# EAGLE design Projet_Schematics (EAGLE 9.5.2)
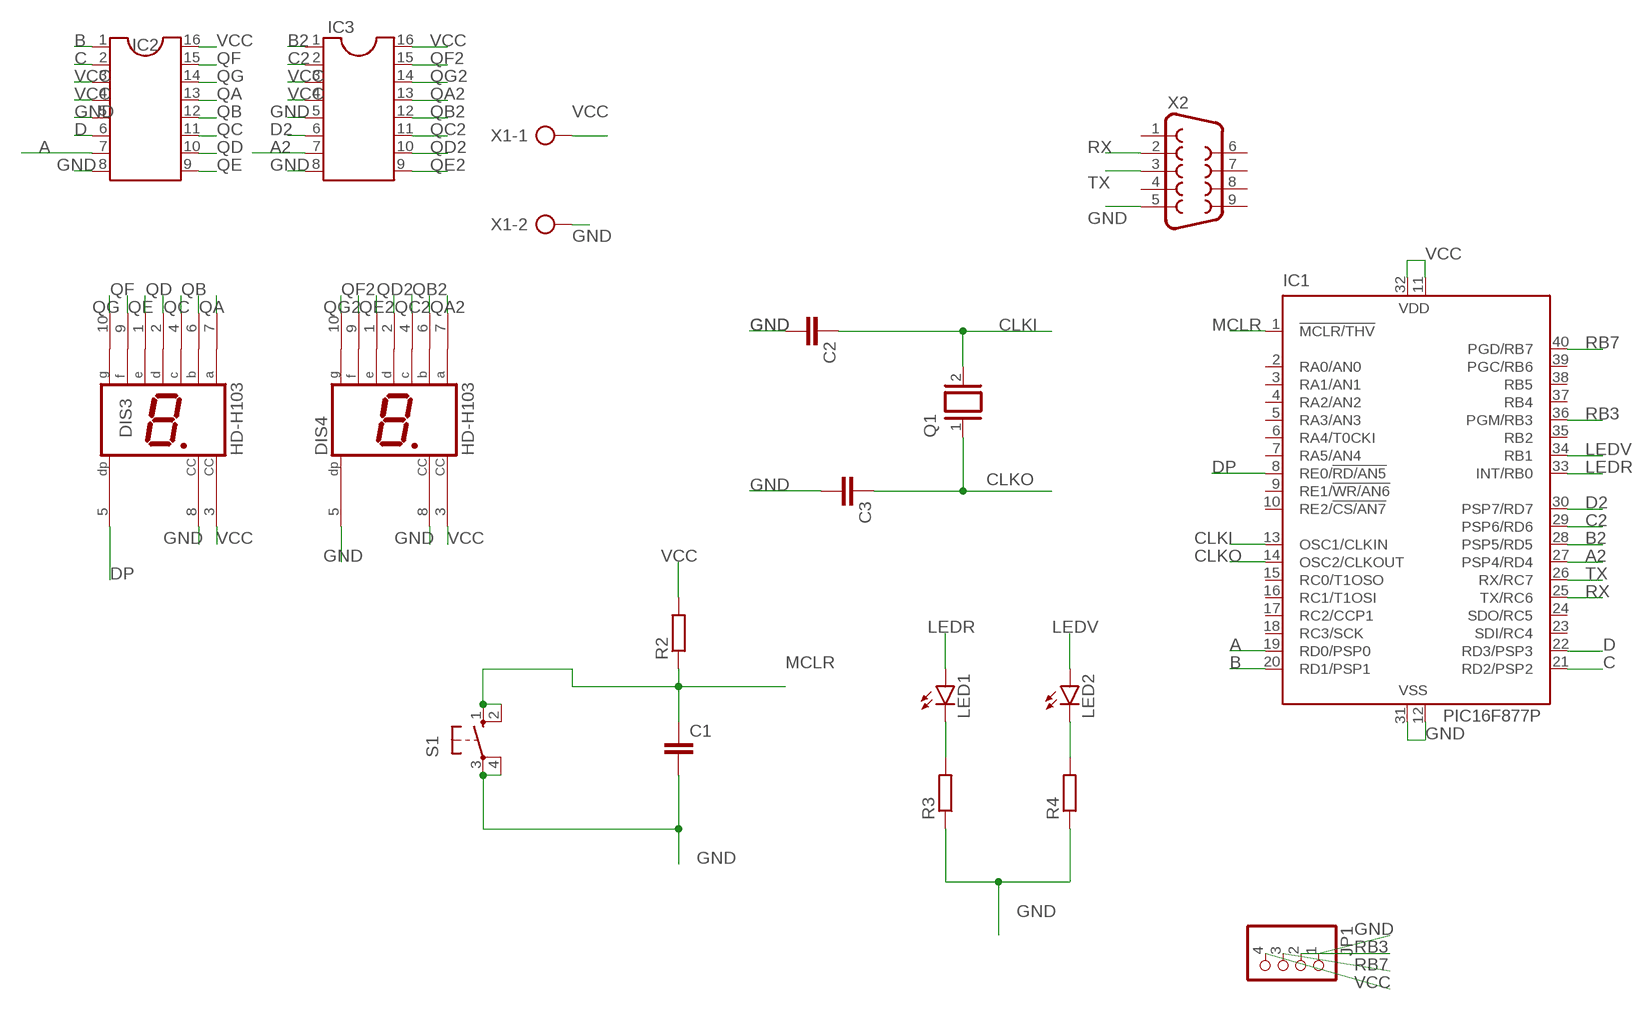
[diagram p0: schematic, sheet 1]

## Parts
C1  C-EU025-030X050  [C025-030X050]
C2  C-EU025-030X050  [C025-030X050]
C3  C-EU025-030X050  [C025-030X050]
DIS3  HD-H103  [HDSP-M]
DIS4  HD-H103  [HDSP-M]
IC1  PIC16F877P  [DIL40]
IC2  DIL16  [DIL16]
IC3  DIL16  [DIL16]
JP1  PINHD-1X4  [1X04]
LED1  LED5MM  [LED5MM]
LED2  LED5MM  [LED5MM]
Q1  XTAL/S  [QS]
R2  R-EU_0204/7  [0204/7]
R3  R-EU_0204/7  [0204/7]
R4  R-EU_0204/7  [0204/7]
S1  10-XX  [B3F-10XX]
X1  AK300/2  [AK300/2]
X2  F09H  [F09H]

## Nets
A: IC1.19(RD0/PSP0) IC2.7
A2: IC1.27(PSP4/RD4) IC3.7
B: IC1.20(RD1/PSP1) IC2.1
B2: IC1.28(PSP5/RD5) IC3.1
C: IC1.21(RD2/PSP2) IC2.2
C2: IC1.29(PSP6/RD6) IC3.2
CLKI: C2.1 IC1.13(OSC1/CLKIN) Q1.2
CLKO: C3.1 IC1.14(OSC2/CLKOUT) Q1.1
D: IC1.22(RD3/PSP3) IC2.6
D2: IC1.30(PSP7/RD7) IC3.6
DP: DIS3.5(DP) IC1.8(RE0/!RD/AN5)
GND: C1.2 C2.2 C3.2 DIS3.8(CC) DIS4.5(DP) DIS4.8(CC) IC1.12(VSS) IC1.31(VSS) IC2.5 IC2.8 IC3.5 IC3.8 JP1.1 R3.1 R4.1 S1.3(P) S1.4(P1) X1.2 X2.5
LEDR: IC1.33(INT/RB0) LED1.A
LEDV: IC1.34(RB1) LED2.A
MCLR: C1.1 IC1.1(!MCLR/THV) R2.1 S1.1(S) S1.2(S1)
N$1: LED1.K(C) R3.2
N$2: LED2.K(C) R4.2
QA: DIS3.7(A) IC2.13
QA2: DIS4.7(A) IC3.13
QB: DIS3.6(B) IC2.12
QB2: DIS4.6(B) IC3.12
QC: DIS3.4(C) IC2.11
QC2: DIS4.4(C) IC3.11
QD: DIS3.2(D) IC2.10
QD2: DIS4.2(D) IC3.10
QE: DIS3.1(E) IC2.9
QE2: DIS4.1(E) IC3.9
QF: DIS3.9(F) IC2.15
QF2: DIS4.9(F) IC3.15
QG: DIS3.10(G) IC2.14
QG2: DIS4.10(G) IC3.14
RB3: IC1.36(PGM/RB3) JP1.2
RB7: IC1.40(PGD/RB7) JP1.3
RX: IC1.25(TX/RC6) X2.2
TX: IC1.26(RX/RC7) X2.3
VCC: DIS3.3(CC) DIS4.3(CC) IC1.11(VDD) IC1.32(VDD) IC2.3 IC2.4 IC2.16 IC3.3 IC3.4 IC3.16 JP1.4 R2.2 X1.1
Unconnected: IC1.2(RA0/AN0) IC1.3(RA1/AN1) IC1.4(RA2/AN2) IC1.5(RA3/AN3) IC1.6(RA4/T0CKI) IC1.7(RA5/AN4) IC1.9(RE1/!WR/AN6) IC1.10(RE2/!CS/AN7) IC1.15(RC0/T1OSO) IC1.16(RC1/T1OSI) IC1.17(RC2/CCP1) IC1.18(RC3/SCK) IC1.23(SDI/RC4) IC1.24(SDO/RC5) IC1.35(RB2) IC1.37(RB4) IC1.38(RB5) IC1.39(PGC/RB6) X2.1 X2.4 X2.6 X2.7 X2.8 X2.9

## Library data of the parts
C1-C3 = rcl:C-EU: CAPACITOR, European symbol; SPICEPREFIX: C
DIS3 DIS4 = display-hp:HD-H103: LED DISPLAY 1-character 7 segment, decimal point right; OC_FARNELL: unknown; OC_NEWARK: unknown
IC1 = microchip:PIC16F87*: MICROCONTROLLER; MF: MICROCHIP; MPN: PIC16F877-04/P; OC_FARNELL: 9761349; OC_NEWARK: 61K3463
IC2 IC3 = ic-package:DIL16: Dual In Line / Socket
JP1 = pinhead:PINHD-1X4: PIN HEADER
LED1 LED2 = led:LED: LED OSRAM: - CHIPLED LG R971, LG N971, LY N971, LG Q971, LY Q971, LO R971, LY R971 LH N974, LH R974 LS Q976, LO Q976, LY Q976 LO Q996 - Hyper CHIPLED LW Q18S LB Q993, LB Q99A, LB R99A - SideLED LS A670, LO A670, LY A670, LG A670, LP A670 LB A673, LV A673, LT A673, LW A673 LH A674 LY A675 LS A676, LA A676, LO A676, LY A676, LW A676 LS A679, LY A679, LG A679 - Hyper Micro SIDELED® LS Y876, LA Y876, LO Y876, LY Y876 LT Y87S - SmartLED LW L88C, LW L88S LB L89C, LB L89S, LG L890 LS L89K, LO L89K, LY L89K LS L896, LA L896, LO L896, LY L896 - TOPLED LS T670, LO T670, LY T670, LG T670, LP T670 LSG T670, LSP T670, LSY T670, LOP T670, LYG T670 LG T671, LOG T671, LSG T671 LB T673, LV T673, LT T673, LW T673 LH T674 LS T676, LA T676, LO T676, LY T676, LB T676, LH T676, LSB T676, LW T676 LB T67C, LV T67C, LT T67C, LS T67K, LO T67K, LY T67K, LW E67C LS E67B, LA E67B, LO E67B, LY E67B, LB E67C, LV E67C, LT E67C LW T67C LS T679, LY T679, LG T679 LS T770, LO T770, LY T770, LG T770, LP T770 LB T773, LV T773, LT T773, LW T773 LH T774 LS E675, LA E675, LY E675, LS T675 LS T776, LA T776, LO T776, LY T776, LB T776 LHGB T686 LT T68C, LB T68C - Hyper Mini TOPLED® LB M676 - Mini TOPLED Santana® LG M470 LS M47K, LO M47K, LY M47K Source: http://www.osram.convergy.de LUXEON: - LUMILED® LXK2-PW12-R00, LXK2-PW12-S00, LXK2-PW14-U00, LXK2-PW14-V00 LXK2-PM12-R00, LXK2-PM12-S00, LXK2-PM14-U00 LXK2-PE12-Q00, LXK2-PE12-R00, LXK2-PE12-S00, LXK2-PE14-T00, LXK2-PE14-U00 LXK2-PB12-K00, LXK2-PB12-L00, LXK2-PB12-M00, LXK2-PB14-N00, LXK2-PB14-P00, LXK2-PB14-Q00 LXK2-PR12-L00, LXK2-PR12-M00, LXK2-PR14-Q00, LXK2-PR14-R00 LXK2-PD12-Q00, LXK2-PD12-R00, LXK2-PD12-S00 LXK2-PH12-R00, LXK2-PH12-S00 LXK2-PL12-P00, LXK2-PL12-Q00, LXK2-PL12-R00 Source: www.luxeon.com KINGBRIGHT: KA-3528ASYC Source: www.kingbright.com
Q1 = special:XTAL/S: CRYSTAL
R2-R4 = rcl:R-EU_: RESISTOR, European symbol; SPICEPREFIX: R
S1 = switch-omron:10-XX: OMRON SWITCH; MPN: B3F-1000; OC_FARNELL: 176432; OC_NEWARK: 36M3542
X1 = con-ptr500:AK300/2: CONNECTOR; OC_FARNELL: unknown; OC_NEWARK: unknown
X2 = con-subd:F09: SUB-D; OC_FARNELL: unknown; OC_NEWARK: unknown

## Board
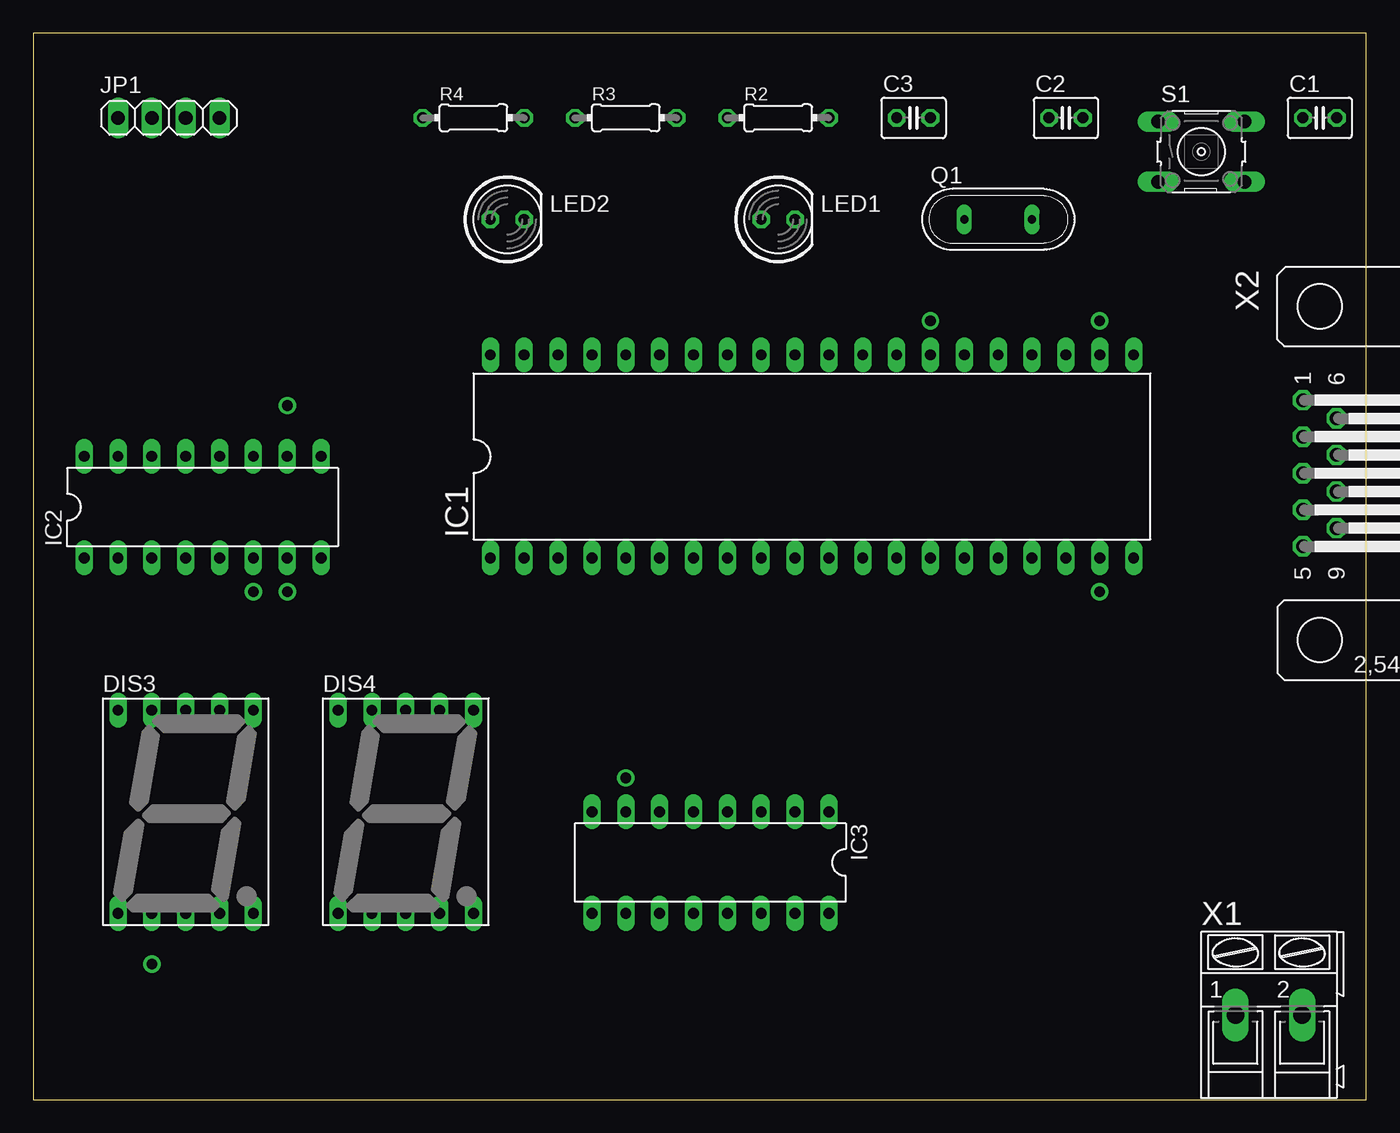
[diagram p1: board, top side]
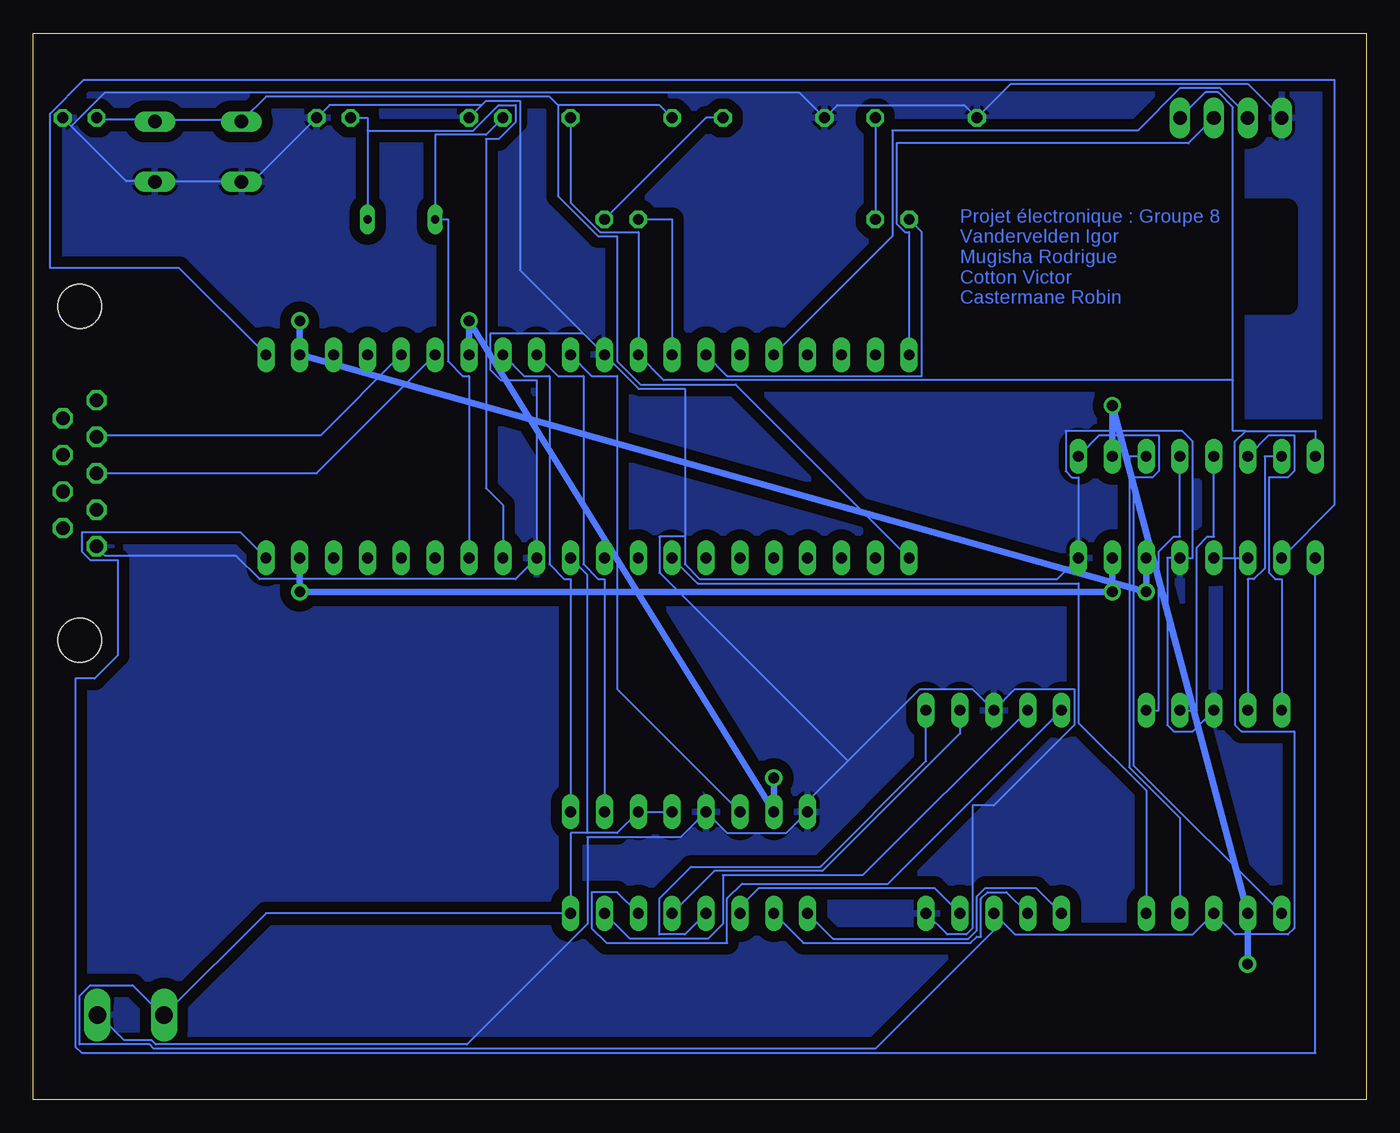
[diagram p2: board, bottom side, seen from below]

Size 100 x 80 mm. Coordinates in mm from the lower left corner, seen from the top.
Outline: 0,0 100,0 100,80 0,80 0,0
Copper layers (1*16): Top 0.035mm / dielectric 1.5mm / Bottom 0.035mm
Design rules "default": minimum track width 6mil, minimum drill 0.35mm, track to track 6mil, track to pad 6mil, pad to pad 6mil, via to via 6mil, smd to smd 6mil, copper to edge 40mil, drill to drill 6mil, minimum pad ring 10mil, minimum via ring 8mil, stop-mask expansion 4mil, vias tented up to drill 0mil, thermal gap 10mil

### Footprints (pad centres in the part's own frame; a part is rotated, then mirrored left to right if it is on the bottom)
C025-030X050 = drill 0.813 octagon: 1 -1.27,0; 2 1.27,0
HDSP-M = drill 0.813 long: 1 -5.08,-7.62; 2 -2.54,-7.62; 3 0,-7.62; 4 2.54,-7.62; 5 5.08,-7.62; 6 5.08,7.62; 7 2.54,7.62; 8 0,7.62; 9 -2.54,7.62; 10 -5.08,7.62
DIL40 = drill 0.813 long: 1 -24.13,-7.62; 2 -21.59,-7.62; 3 -19.05,-7.62; 4 -16.51,-7.62; 5 -13.97,-7.62; 6 -11.43,-7.62; 7 -8.89,-7.62; 8 -6.35,-7.62; 9 -3.81,-7.62; 10 -1.27,-7.62; 11 1.27,-7.62; 12 3.81,-7.62; 13 6.35,-7.62; 14 8.89,-7.62; 15 11.43,-7.62; 16 13.97,-7.62; 17 16.51,-7.62; 18 19.05,-7.62; 19 21.59,-7.62; 20 24.13,-7.62; 21 24.13,7.62; 22 21.59,7.62; 23 19.05,7.62; 24 16.51,7.62; 25 13.97,7.62; 26 11.43,7.62; 27 8.89,7.62; 28 6.35,7.62; 29 3.81,7.62; 30 1.27,7.62; 31 -1.27,7.62; 32 -3.81,7.62; 33 -6.35,7.62; 34 -8.89,7.62; 35 -11.43,7.62; 36 -13.97,7.62; 37 -16.51,7.62; 38 -19.05,7.62; 39 -21.59,7.62; 40 -24.13,7.62
DIL16 = drill 0.813 long: 1 -8.89,-3.81; 2 -6.35,-3.81; 3 -3.81,-3.81; 4 -1.27,-3.81; 5 1.27,-3.81; 6 3.81,-3.81; 7 6.35,-3.81; 8 8.89,-3.81; 9 8.89,3.81; 10 6.35,3.81; 11 3.81,3.81; 12 1.27,3.81; 13 -1.27,3.81; 14 -3.81,3.81; 15 -6.35,3.81; 16 -8.89,3.81
1X04 = drill 1.016 long: 1 -3.81,0; 2 -1.27,0; 3 1.27,0; 4 3.81,0
LED5MM = drill 0.813 octagon: A -1.27,0; K 1.27,0
QS = drill 0.61 long: 1 -2.54,0; 2 2.54,0
0204/7 = drill 0.813 octagon: 1 -3.81,0; 2 3.81,0
B3F-10XX = drill 1.016 long: 1 -3.251,2.261; 2 3.251,2.261; 3 -3.251,-2.261; 4 3.251,-2.261
AK300/2 = drill 1.321 long: 1 -2.515,0; 2 2.489,0
F09H = drill 1.016 octagon: 1 -5.486,-1.27; 2 -2.743,-1.27; 3 0,-1.27; 4 2.743,-1.27; 5 5.486,-1.27; 6 -4.115,1.27; 7 -1.372,1.27; 8 1.372,1.27; 9 4.115,1.27 | hole 3.302: -12.522,0; 12.522,0

### Placement (x,y rotation side)
C1  96.52,73.66 0 top
C2  77.47,73.66 0 top
C3  66.04,73.66 0 top
DIS3  11.43,21.59 0 top
DIS4  27.94,21.59 0 top
IC1  58.42,48.26 0 top
IC2  12.7,44.45 0 top
IC3  50.8,17.78 180 top
JP1  10.16,73.66 0 top
LED1  55.88,66.04 0 top
LED2  35.56,66.04 0 top
Q1  72.39,66.04 0 top
R2  55.88,73.66 0 top
R3  44.45,73.66 0 top
R4  33.02,73.66 0 top
S1  87.63,71.12 0 top
X1  92.71,6.35 0 top
X2  96.52,46.99 270 top

### Tracks (layer width: path | path; a pad name or v marks a point on that pad's centre or on a via)
A  (via drill 0.8 pad 1.3)
  Bottom 0.5: IC2.7 v19.05,38.1 v80.01,38.1 IC1.19
A2  (via drill 0.8 pad 1.3)
  Bottom 0.5: v44.45,24.13 IC3.7 v67.31,58.42 IC1.27
B
  Bottom 0.152: IC2.1 3.81,3.49 96.36,3.49 96.84,3.97 96.84,31.59 95.41,31.59 93.66,33.34 93.66,40.48 95.73,40.48 96.36,41.12 96.36,42.55 84.45,42.55 IC1.20
B2
  Bottom 0.152: IC3.1 59.69,39.05 60.17,39.05 61.28,40.16 61.28,54.29 63.18,54.29 IC1.28
C
  Bottom 0.152: IC2.2 2.38,44.61 2.38,76.52 96.2,76.52 98.74,73.98 98.74,62.39 89.06,62.39 IC1.21
C2
  Bottom 0.152: IC3.2 57.15,39.05 57.63,39.05 58.74,40.16 58.74,54.29 60.64,54.29 IC1.29
CLKI
  Bottom 0.152: 74.93,72.71 74.93,73.66 C2.1 | 74.93,72.71 Q1.2 | IC1.13 64.77,44.61 66.04,45.88 66.04,72.07 65.09,72.07 63.82,73.34 63.82,74.61 65.09,74.61 66.99,72.71 74.93,72.71
CLKO
  Bottom 0.152: C3.1 66.04,72.39 69.85,72.39 Q1.1 68.9,66.04 68.9,55.4 67.79,54.29 67.31,54.29 IC1.14
D  (via drill 0.8 pad 1.3)
  Bottom 0.5: v80.01,58.42 IC1.22 v16.51,38.1 IC2.6
D2
  Bottom 0.152: IC3.6 56.2,30.8 56.2,54.29 58.1,54.29 IC1.30
DP
  Bottom 0.152: DIS3.5 16.51,23.18 21.59,28.26 21.59,38.73 50.16,38.73 IC1.8
GND
  Bottom 0.152: DIS4.5 31.43,12.38 30,12.38 29.53,12.86 29.53,22.07 27.94,22.07 21.91,28.1 21.91,30.8 26.35,30.8 DIS4.8 29.53,30.8 33.5,30.8 38.89,25.4 | X1.2 95.09,6.35 93.19,4.45 91.12,4.45 90.81,4.13 67.47,4.13 58.42,13.18 58.42,19.68 51.44,19.68 IC3.5 47.94,20 43.5,20 IC3.8 41.91,22.38 38.89,25.4 | JP1.1 8.89,76.2 26.67,76.2 R4.1 30.16,74.61 39.69,74.61 R3.1 42.55,75.56 94.61,75.56 97.16,73.03 | DIS3.8 13.02,27.62 14.45,27.62 14.92,28.1 14.92,40.64 IC2.5 13.02,40.64 13.02,49.37 13.81,50.16 22.54,50.16 22.54,47.15 22.07,46.67 21.59,46.67 IC2.8 23.18,39.05 50.01,39.05 51.12,40.16 51.12,42.23 | 97.16,73.03 93.03,68.9 90.96,68.9 S1.4 90.81,68.9 84.45,68.9 S1.3 84.3,68.9 83.5,68.9 C2.2 77.79,74.61 66.36,74.61 | 97.16,73.03 C1.2 | 58.74,57.47 63.5,62.23 63.5,74.93 66.04,74.93 66.36,74.61 | 58.74,57.47 IC1.31 54.61,53.34 51.12,53.34 51.12,42.23 | C3.2 66.36,74.61 | 58.74,57.47 65.72,57.47 65.72,54.77 64.93,53.98 62.23,53.98 IC1.12 63.82,39.05 83.03,39.05 84.77,40.8 94.61,40.8 95.25,41.43 X2.5 | 38.89,25.4 53.02,39.53 53.02,42.23 51.12,42.23
  pour Bottom (isolate 0.813): 0,80.01 0,0 100.33,0 100.33,80.01
LEDR
  Bottom 0.152: IC1.33 52.07,66.04 LED1.A
LEDV
  Bottom 0.152: LED2.A 33.34,65.09 33.34,54.29 47.94,54.29 IC1.34
MCLR
  Bottom 0.152: C1.1 95.09,73.5 90.96,73.5 S1.2 90.81,73.5 84.45,73.5 S1.1 84.3,73.5 82.55,75.25 61.28,75.25 60.64,74.61 | IC1.1 47.31,53.66 54.45,53.66 56.2,55.4 56.2,64.77 57.63,64.77 60.64,67.79 60.64,74.61 | 60.64,74.61 53.02,74.61 R2.1
N$1
  Bottom 0.152: LED1.K 49.53,73.66 R3.2
N$2
  Bottom 0.152: R4.2 LED2.K
QA
  Bottom 0.152: IC2.13 11.43,42.23 11.91,42.23 12.7,41.43 12.7,29.21 DIS3.7
QA2
  Bottom 0.152: IC3.13 48.9,17.14 40.8,17.14 30.48,27.46 DIS4.7
QB
  Bottom 0.152: IC2.12 13.97,42.23 14.45,42.23 15.56,41.12 15.56,29.21 DIS3.6
QB2
  Bottom 0.152: DIS4.6 33.02,25.4 40.96,17.46 50.64,17.46 53.02,15.08 53.02,12.38 51.12,12.38 IC3.12
QC
  Bottom 0.152: DIS3.4 13.97,21.11 17.78,24.92 17.78,48.26 IC2.11
QC2
  Bottom 0.152: DIS4.4 32.38,15.88 45.56,15.88 46.99,14.45 IC3.11
QD  (via drill 0.8 pad 1.3)
  Bottom 0.5: v8.89,10.16 DIS3.2 v19.05,52.07 IC2.10
QD2
  Bottom 0.152: DIS4.2 26.99,15.56 28.42,15.56 28.89,15.08 28.89,12.22 29.21,12.22 29.69,11.75 42.23,11.75 IC3.10
QE
  Bottom 0.152: DIS3.1 17.46,25.08 17.46,46.67 16.03,46.67 15.56,47.15 15.56,49.85 20,49.85 IC2.9
QE2
  Bottom 0.152: DIS4.1 24.77,15.88 28.57,15.88 29.21,15.24 29.21,12.7 29.84,12.06 40.01,12.06 IC3.9
QF
  Bottom 0.152: DIS3.9 8.89,39.05 8.41,39.05 7.62,39.85 7.62,48.26 IC2.15
QF2
  Bottom 0.152: IC3.15 55.24,12.06 49.37,12.06 48.26,13.18 48.26,16.83 37.78,16.83 DIS4.9
QG
  Bottom 0.152: DIS3.10 6.35,39.05 6.83,39.05 7.3,39.53 7.3,46.67 5.87,46.67 5.4,47.15 5.4,49.85 7.3,49.85 IC2.14
QG2
  Bottom 0.152: DIS4.10 35.88,16.19 46.83,16.19 47.94,15.08 47.94,11.75 56.99,11.75 58.1,12.86 58.1,15.56 56.2,15.56 IC3.14
RB3
  Bottom 0.152: IC1.36 35.56,64.77 35.56,72.71 17.14,72.71 13.97,75.88 10.95,75.88 8.89,73.82 JP1.2
RB7
  Bottom 0.152: IC1.40 34.29,65.09 34.61,65.09 35.24,65.72 35.24,71.75 13.34,71.75 JP1.3
RX
  Bottom 0.152: IC1.25 78.42,49.85 95.25,49.85 X2.2
TX
  Bottom 0.152: IC1.26 78.74,46.99 X2.3
VCC
  Bottom 0.152: IC3.4 IC3.3 56.2,20 58.42,20 | 58.42,20 59.69,20 IC3.16 82.55,13.97 90.17,6.35 X1.1 90.33,6.35 92.55,8.57 95.73,8.57 96.52,7.78 96.52,4.13 91.28,4.13 90.96,3.81 36.83,3.81 27.3,13.34 | IC1.11 58.42,39.37 58.42,20 | R2.2 59.69,67.31 57.47,65.09 54.61,65.09 IC1.32 52.7,53.98 10,53.98 | 27.3,13.34 26.35,12.38 13.02,12.38 DIS3.3 9.84,12.38 5.87,12.38 5.4,12.86 5.4,27.62 9.37,27.62 9.84,28.1 9.84,40.64 | IC2.4 9.84,40.64 | 9.84,40.64 IC2.3 | IC2.16 3.81,50.16 9.05,50.16 | 9.05,50.16 9.84,49.37 9.84,40.64 | JP1.4 12.06,75.56 11.11,75.56 10,74.45 10,53.98 | 10,53.98 10,50.16 9.05,50.16 | 27.3,13.34 DIS4.3

### Text on the board
Bottom: Projet électronique : Groupe 8 / Vandervelden Igor / Mugisha Rodrigue / Cotton Victor / Castermane Robin